# EAGLE schematic ServoControllerCircuit (EAGLE 9.1.1)
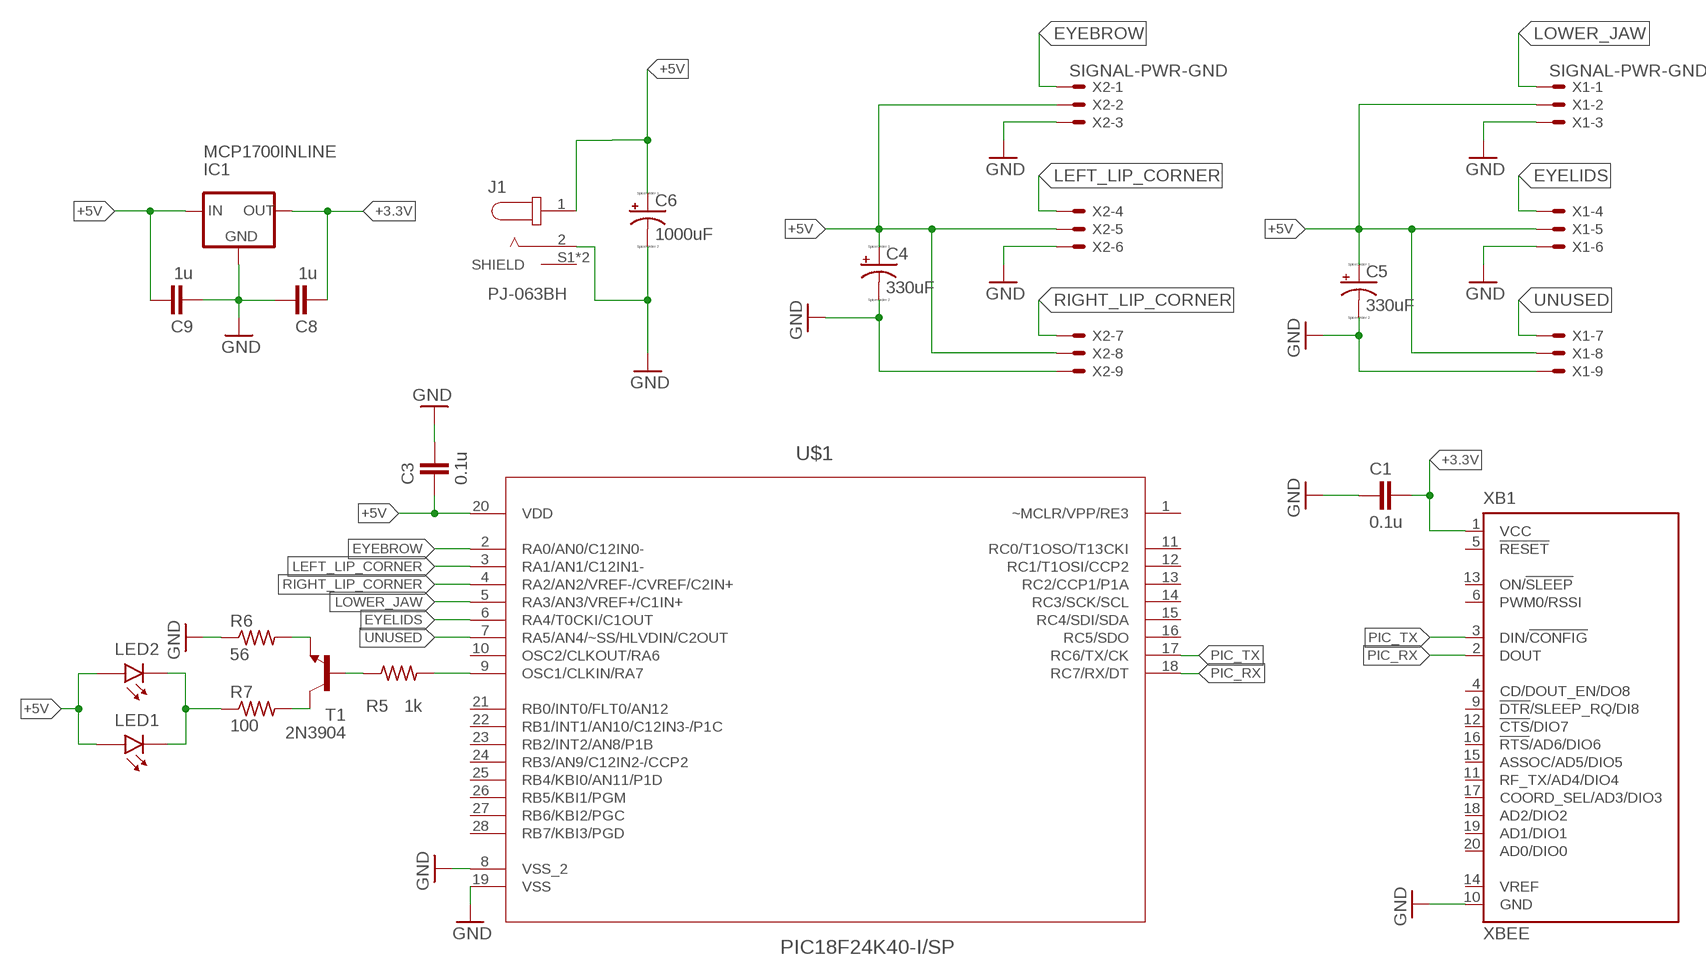
[diagram p0: schematic, sheet 1]

## Parts
C1  0.1u  C-EU050-025X075  [C050-025X075]
C3  0.1u  C-EU050-025X075  [C050-025X075]
C4  330uF  CPOL-USE3.5-8  [E3,5-8]
C5  330uF  CPOL-USE3.5-8  [E3,5-8]
C6  1000uF  CPOL-USE5-10.5  [E5-10,5]
C8  1u  C-EU050-025X075  [C050-025X075]
C9  1u  C-EU050-025X075  [C050-025X075]
IC1  MCP1700INLINE  [TO92-INLINE]
J1  PJ-063BH  [CUI_PJ-063BH]
LED1  REMOTE_LED  [REMOTE_LED]
LED2  REMOTE_LED  [REMOTE_LED]
R5  1k  R-US_0207/12  [0207/12]
R6  56  R-US_0207/12  [0207/12]
R7  100  R-US_0207/12  [0207/12]
T1  2N3904  [TO92]
U$1  PIC18F24K40-I/SP  PIC18F24K20-I/SP  [DIP254P762X508-28]
X1  SIGNAL-PWR-GND  22-23-2091  [22-23-2091]
X2  SIGNAL-PWR-GND  22-23-2091  [22-23-2091]
XB1  XBEE  [XBEE]

## Nets
+3.3V: C1.1 C8.2 IC1.3(OUT) XB1.1(VCC)
+5V: C3.2 C4.+ C5.+ C6.+ C9.1 IC1.2(IN) J1.1 LED1.P$1 LED2.P$1 U$1.20(VDD) X1.2 X1.5 X1.8 X2.2 X2.5 X2.8
EYEBROW: U$1.2(RA0/AN0/C12IN0-) X2.1
EYELIDS: U$1.6(RA4/T0CKI/C1OUT) X1.4
GND: C1.2 C3.1 C4.- C5.- C6.- C8.1 C9.2 IC1.1(GND) J1.2 R6.1 U$1.8(VSS_2) U$1.19(VSS) X1.3 X1.6 X1.9 X2.3 X2.6 X2.9 XB1.10(GND)
LEFT_LIP_CORNER: U$1.3(RA1/AN1/C12IN1-) X2.4
LIGHTS: R5.2 U$1.9(OSC1/CLKIN/RA7)
LOWER_JAW: U$1.5(RA3/AN3/VREF+/C1IN+) X1.1
N$5: R5.1 T1.2(B)
N$7: R6.2 T1.3(E)
N$9: R7.2 T1.1(C)
N$10: LED1.P$2 LED2.P$2 R7.1
PIC_RX: U$1.18(RC7/RX/DT) XB1.2(DOUT)
PIC_TX: U$1.17(RC6/TX/CK) XB1.3(DIN/!CONFIG)
RIGHT_LIP_CORNER: U$1.4(RA2/AN2/VREF-/CVREF/C2IN+) X2.7
UNUSED: U$1.7(RA5/AN4/~SS/HLVDIN/C2OUT) X1.7
Unconnected: U$1.1(~MCLR/VPP/RE3) U$1.10(OSC2/CLKOUT/RA6) U$1.11(RC0/T1OSO/T13CKI) U$1.12(RC1/T1OSI/CCP2) U$1.13(RC2/CCP1/P1A) U$1.14(RC3/SCK/SCL) U$1.15(RC4/SDI/SDA) U$1.16(RC5/SDO) U$1.21(RB0/INT0/FLT0/AN12) U$1.22(RB1/INT1/AN10/C12IN3-/P1C) U$1.23(RB2/INT2/AN8/P1B) U$1.24(RB3/AN9/C12IN2-/CCP2) U$1.25(RB4/KBI0/AN11/P1D) U$1.26(RB5/KBI1/PGM) U$1.27(RB6/KBI2/PGC) U$1.28(RB7/KBI3/PGD) XB1.4(CD/DOUT_EN/DO8) XB1.5(!RESET) XB1.6(PWM0/RSSI) XB1.9(!DTR!/SLEEP_RQ/DI8) XB1.11(RF_TX/AD4/DIO4) XB1.12(!CTS!/DIO7) XB1.13(ON/!SLEEP) XB1.14(VREF) XB1.15(ASSOC/AD5/DIO5) XB1.16(!RTS!/AD6/DIO6) XB1.17(COORD_SEL/AD3/DIO3) XB1.18(AD2/DIO2) XB1.19(AD1/DIO1) XB1.20(AD0/DIO0)

## Power pins joined to a net without a drawn wire
SHIELD: J1.S1(SHIELD) J1.S2(SHIELD)

## Library data of the parts
C1 C3 C8 C9 = resistor:C-EU: CAPACITOR, European symbol
C4-C6 = resistor:CPOL-US: POLARIZED CAPACITOR, American symbol
IC1 = MCP1700:MCP1700: VOLTAGE REGULATOR; AVAILABILITY: Unavailable; MF: Microchip; MP: MCP1700; PACKAGE: None; PRICE: None
J1 = PJ-063BH:PJ-063BH: 2.5 mm Center Pin, 8.0 A, Right Angle, Through Hole, Shielded, Kinked Pins, Dc Power Jack Connector; MANUFACTURER: CUI INC; PARTREV: 1.02; STANDARD: Manufacturer recommendations
LED1 LED2 = REMOTE_LED:REMOTE_LED
R5-R7 = resistor:R-US_: RESISTOR, American symbol
T1 = transistor:2N3904: NPN TRANSISTOR
U$1 = Microchip_By_element14_Batch_1:PIC18F24K20-I/SP: Flash Microcontrollers; DESCRIPTION: Flash Microcontrollers; MPN: PIC18F24K20-I/SP; OC_FARNELL: 1439575; OC_NEWARK: 88K5968; PACKAGE: DIP-28; SUPPLIER: Microchip
X1 X2 = con-molex:22-23-2091: .100" (2.54mm) Center Header - 9 Pin; MF: MOLEX; MPN: 22-23-2091; OC_FARNELL: 1756827; OC_NEWARK: 56H0450
XB1 = maxstream:XBEE: XBee (TM) /XBee-PRO(TM) OEM RF Modules Source: MaxStream, Inc. xbee_productmanual.pdf; MPN: XBP24-Z7UIT-004; OC_FARNELL: 1751799; OC_NEWARK: 34R5507